# Altium project OSPLC2_2_IO.PrjPCB
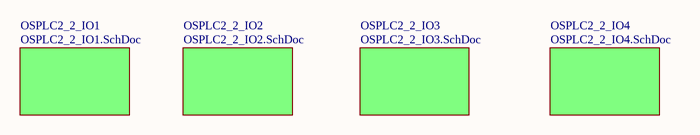
[diagram p0: OSPLC2_2_IO_Top.SchDoc]
5 sheets, 296 parts. Net scope: global (net labels, ports and power ports of the same name join across sheets).
Board file: OSPLC2_2_IO.PcbDoc
Sheets:
  OSPLC2_2_IO_Top.SchDoc
    OSPLC2_2_IO1 = OSPLC2_2_IO1.SchDoc
    OSPLC2_2_IO2 = OSPLC2_2_IO2.SchDoc
    OSPLC2_2_IO3 = OSPLC2_2_IO3.SchDoc
    OSPLC2_2_IO4 = OSPLC2_2_IO4.SchDoc

## Sheet OSPLC2_2_IO_Top.SchDoc
size 294 x 198 mm

### Sub-sheets
OSPLC2_2_IO1 = OSPLC2_2_IO1.SchDoc: no entries
OSPLC2_2_IO2 = OSPLC2_2_IO2.SchDoc: no entries
OSPLC2_2_IO3 = OSPLC2_2_IO3.SchDoc: no entries
OSPLC2_2_IO4 = OSPLC2_2_IO4.SchDoc: no entries

## Sheet OSPLC2_2_IO1.SchDoc
size 294 x 198 mm
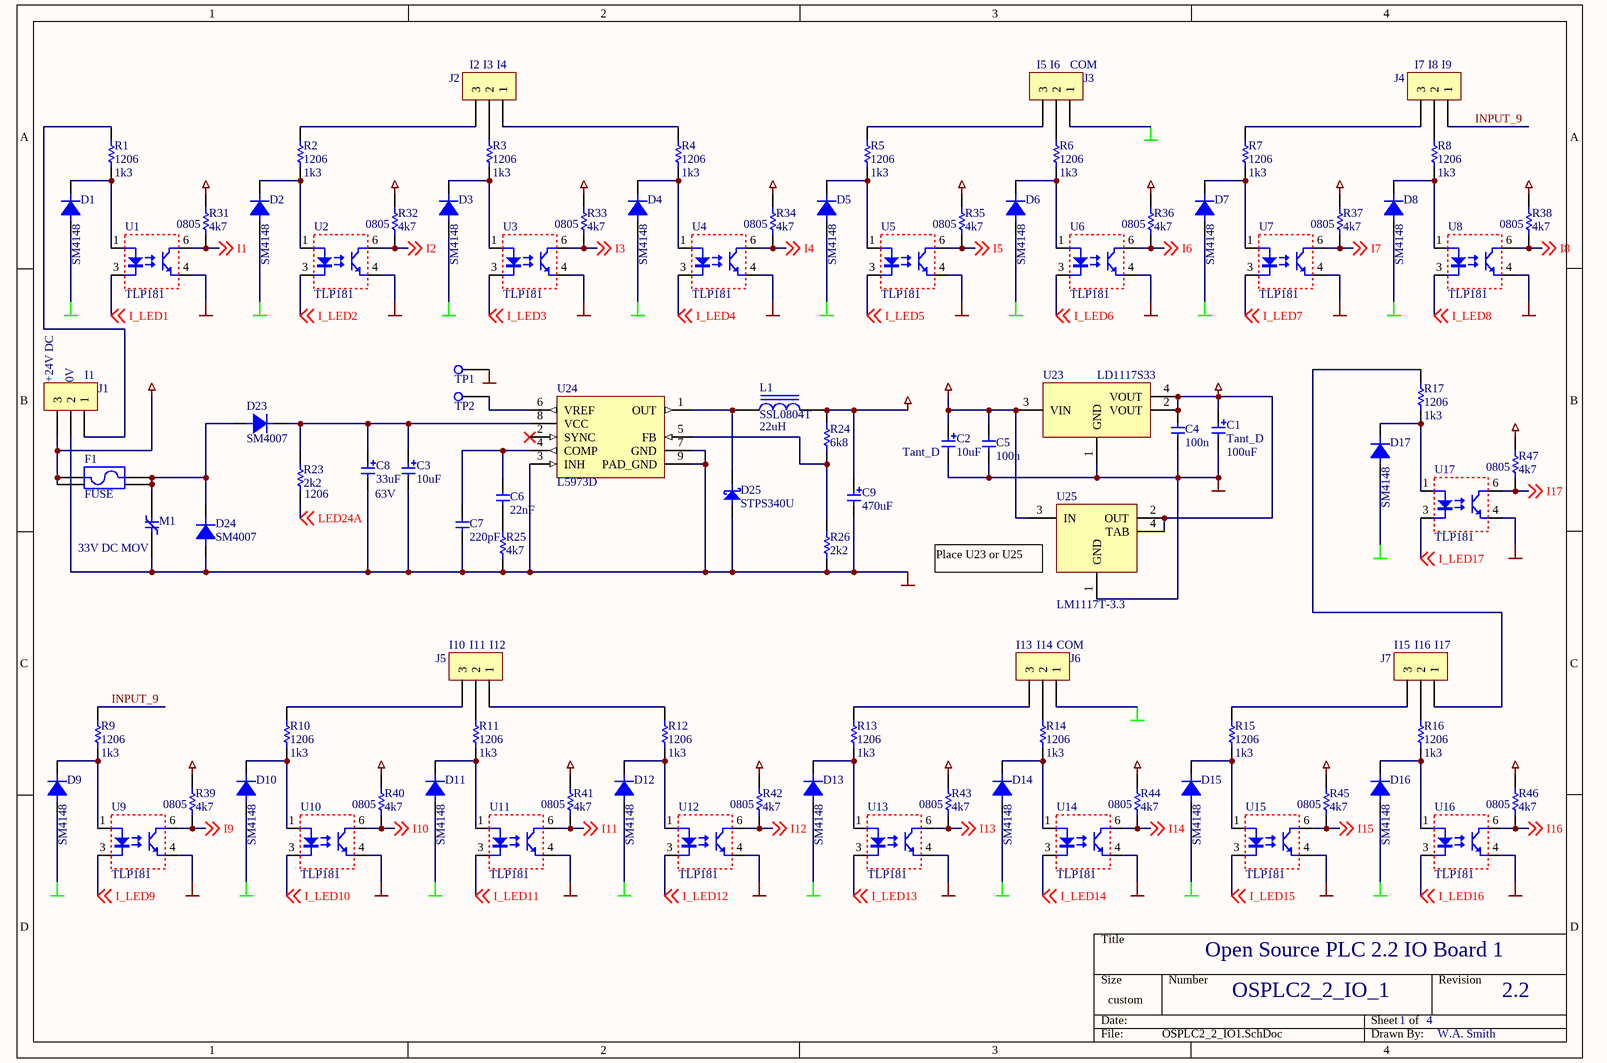
[diagram p1: OSPLC2_2_IO1.SchDoc]

### Parts
C1  Tant_D  value 100uF  [CAP_TANT_D]
C2  Tant_D  value 10uF  [CAP_TANT_D]
C3  value 10uF  [CAP_100_RP]  (hidden comment: CAP_100_RP)
C4  value 100n  [0805]  (hidden comment: 0805)
C5  value 100n  [0805]  (hidden comment: 0805)
C6  value 22nF  [0805]  (hidden comment: 0805)
C7  value 220pF  [0805]  (hidden comment: 0805)
C8  63V  value 33uF  [CAP_100_RP]
C9  value 470uF  [CAP_200_RP]  (hidden comment: CAP_200_RP)
D1  SM4148  [MELF-R2/X1.6]
D2  SM4148  [MELF-R2/X1.6]
D3  SM4148  [MELF-R2/X1.6]
D4  SM4148  [MELF-R2/X1.6]
D5  SM4148  [MELF-R2/X1.6]
D6  SM4148  [MELF-R2/X1.6]
D7  SM4148  [MELF-R2/X1.6]
D8  SM4148  [MELF-R2/X1.6]
D9  SM4148  [MELF-R2/X1.6]
D10  SM4148  [MELF-R2/X1.6]
D11  SM4148  [MELF-R2/X1.6]
D12  SM4148  [MELF-R2/X1.6]
D13  SM4148  [MELF-R2/X1.6]
D14  SM4148  [MELF-R2/X1.6]
D15  SM4148  [MELF-R2/X1.6]
D16  SM4148  [MELF-R2/X1.6]
D17  SM4148  [MELF-R2/X1.6]
D23  SM4007  [MELF-2.2x2.5]
D24  SM4007  [MELF-2.2x2.5]
D25  STPS340U  [STPS2L25U]
F1  FUSE  [FUSE_MULT]
J1  PCB TERMINAL  [TERMINAL_3WAY_5MM]  (value not drawn)
J2  PCB TERMINAL  [TERMINAL_3WAY_5MM]  (value not drawn)
J3  PCB TERMINAL  [TERMINAL_3WAY_5MM]  (value not drawn)
J4  PCB TERMINAL  [TERMINAL_3WAY_5MM]  (value not drawn)
J5  PCB TERMINAL  [TERMINAL_3WAY_5MM]  (value not drawn)
J6  PCB TERMINAL  [TERMINAL_3WAY_5MM]  (value not drawn)
J7  PCB TERMINAL  [TERMINAL_3WAY_5MM]  (value not drawn)
L1  SSL0804T  [SSL0804]
M1  33V DC MOV  [MOV_7.6mm]
R1  1206  value 1k3  [1206]
R2  1206  value 1k3  [1206]
R3  1206  value 1k3  [1206]
R4  1206  value 1k3  [1206]
R5  1206  value 1k3  [1206]
R6  1206  value 1k3  [1206]
R7  1206  value 1k3  [1206]
R8  1206  value 1k3  [1206]
R9  1206  value 1k3  [1206]
R10  1206  value 1k3  [1206]
R11  1206  value 1k3  [1206]
R12  1206  value 1k3  [1206]
R13  1206  value 1k3  [1206]
R14  1206  value 1k3  [1206]
R15  1206  value 1k3  [1206]
R16  1206  value 1k3  [1206]
R17  1206  value 1k3  [1206]
R23  1206  value 2k2  [1206]
R24  value 6k8  [0805]  (hidden comment: 0805)
R25  value 4k7  [0805]  (hidden comment: 0805)
R26  value 2k2  [0805]  (hidden comment: 0805)
R31  0805  value 4k7  [0805]
R32  0805  value 4k7  [0805]
R33  0805  value 4k7  [0805]
R34  0805  value 4k7  [0805]
R35  0805  value 4k7  [0805]
R36  0805  value 4k7  [0805]
R37  0805  value 4k7  [0805]
R38  0805  value 4k7  [0805]
R39  0805  value 4k7  [0805]
R40  0805  value 4k7  [0805]
R41  0805  value 4k7  [0805]
R42  0805  value 4k7  [0805]
R43  0805  value 4k7  [0805]
R44  0805  value 4k7  [0805]
R45  0805  value 4k7  [0805]
R46  0805  value 4k7  [0805]
R47  0805  value 4k7  [0805]
TP1  TEST POINT  [TEST_POINT_TH]  (value not drawn)
TP2  TEST POINT  [TEST_POINT_TH]  (value not drawn)
U1  TLP181  [SOP4_2.54]
U2  TLP181  [SOP4_2.54]
U3  TLP181  [SOP4_2.54]
U4  TLP181  [SOP4_2.54]
U5  TLP181  [SOP4_2.54]
U6  TLP181  [SOP4_2.54]
U7  TLP181  [SOP4_2.54]
U8  TLP181  [SOP4_2.54]
U9  TLP181  [SOP4_2.54]
U10  TLP181  [SOP4_2.54]
U11  TLP181  [SOP4_2.54]
U12  TLP181  [SOP4_2.54]
U13  TLP181  [SOP4_2.54]
U14  TLP181  [SOP4_2.54]
U15  TLP181  [SOP4_2.54]
U16  TLP181  [SOP4_2.54]
U17  TLP181  [SOP4_2.54]
U23  LD1117S33  [SOT-223]
U24  L5973D  [HSOP8]
U25  LM1117T-3.3  [TO-220_H]

### Nets
GND: C1.2 C2.2 C3.2 C4.2 C5.2 C7.1 C8.2 C9.2 D24.1(A) D25.2(A) J1.2 M1.1 R25.1 R26.1 TP1.1 U1.4 U2.4 U3.4 U4.4 U5.4 U6.4 U7.4 U8.4 U9.4 U10.4 U11.4 U12.4 U13.4 U14.4 U15.4 U16.4 U17.4 U23.1(GND) U24.3(INH) U24.7(GND) U24.9(PAD_GND) U25.1(GND)
IN_GND: D1.1(A) D2.1(A) D3.1(A) D4.1(A) D5.1(A) D6.1(A) D7.1(A) D8.1(A) D9.1(A) D10.1(A) D11.1(A) D12.1(A) D13.1(A) D14.1(A) D15.1(A) D16.1(A) D17.1(A) J3.1 J6.1
VCC3v3: C1.1 C4.1 R31.2 R32.2 R33.2 R34.2 R35.2 R36.2 R37.2 R38.2 R39.2 R40.2 R41.2 R42.2 R43.2 R44.2 R45.2 R46.2 R47.2 U23.2(VOUT) U23.4(VOUT) U25.2(OUT) U25.4(TAB)
VCC5: C2.1 C5.1 C9.1 L1.2 R24.2 U23.3(VIN) U25.3(IN)
VCC24: F1.1 F1.3 J1.3
I1: R31.1 U1.6 ; off-sheet I1
I2: R32.1 U2.6 ; off-sheet I2
I3: R33.1 U3.6 ; off-sheet I3
I4: R34.1 U4.6 ; off-sheet I4
I5: R35.1 U5.6 ; off-sheet I5
I6: R36.1 U6.6 ; off-sheet I6
I7: R37.1 U7.6 ; off-sheet I7
I8: R38.1 U8.6 ; off-sheet I8
I9: R39.1 U9.6 ; off-sheet I9
I10: R40.1 U10.6 ; off-sheet I10
I11: R41.1 U11.6 ; off-sheet I11
I12: R42.1 U12.6 ; off-sheet I12
I13: R43.1 U13.6 ; off-sheet I13
I14: R44.1 U14.6 ; off-sheet I14
I15: R45.1 U15.6 ; off-sheet I15
I16: R46.1 U16.6 ; off-sheet I16
I17: R47.1 U17.6 ; off-sheet I17
I_LED1: U1.3 ; off-sheet I_LED1
I_LED2: U2.3 ; off-sheet I_LED2
I_LED3: U3.3 ; off-sheet I_LED3
I_LED4: U4.3 ; off-sheet I_LED4
I_LED5: U5.3 ; off-sheet I_LED5
I_LED6: U6.3 ; off-sheet I_LED6
I_LED7: U7.3 ; off-sheet I_LED7
I_LED8: U8.3 ; off-sheet I_LED8
I_LED9: U9.3 ; off-sheet I_LED9
I_LED10: U10.3 ; off-sheet I_LED10
I_LED11: U11.3 ; off-sheet I_LED11
I_LED12: U12.3 ; off-sheet I_LED12
I_LED13: U13.3 ; off-sheet I_LED13
I_LED14: U14.3 ; off-sheet I_LED14
I_LED15: U15.3 ; off-sheet I_LED15
I_LED16: U16.3 ; off-sheet I_LED16
I_LED17: U17.3 ; off-sheet I_LED17
INPUT_9: J4.1 R9.2
LED24A: R23.1 ; off-sheet LED24A
NetC3_1: C3.1 C8.1 D23.2(C) R23.2 U24.8(VCC)
NetC6_1: C6.1 R25.2
NetC6_2: C6.2 C7.2 U24.4(COMP)
NetD1_2: D1.2(C) R1.1 U1.1
NetD2_2: D2.2(C) R2.1 U2.1
NetD3_2: D3.2(C) R3.1 U3.1
NetD4_2: D4.2(C) R4.1 U4.1
NetD5_2: D5.2(C) R5.1 U5.1
NetD6_2: D6.2(C) R6.1 U6.1
NetD7_2: D7.2(C) R7.1 U7.1
NetD8_2: D8.2(C) R8.1 U8.1
NetD9_2: D9.2(C) R9.1 U9.1
NetD10_2: D10.2(C) R10.1 U10.1
NetD11_2: D11.2(C) R11.1 U11.1
NetD12_2: D12.2(C) R12.1 U12.1
NetD13_2: D13.2(C) R13.1 U13.1
NetD14_2: D14.2(C) R14.1 U14.1
NetD15_2: D15.2(C) R15.1 U15.1
NetD16_2: D16.2(C) R16.1 U16.1
NetD17_2: D17.2(C) R17.1 U17.1
NetD23_1: D23.1(A) D24.2(C) F1.2 F1.4 M1.2
NetD25_1: D25.1(C) L1.1 U24.1(OUT)
NetJ1_1: J1.1 R1.2
NetJ2_1: J2.1 R4.2
NetJ2_2: J2.2 R3.2
NetJ2_3: J2.3 R2.2
NetJ3_2: J3.2 R6.2
NetJ3_3: J3.3 R5.2
NetJ4_2: J4.2 R8.2
NetJ4_3: J4.3 R7.2
NetJ5_1: J5.1 R12.2
NetJ5_2: J5.2 R11.2
NetJ5_3: J5.3 R10.2
NetJ6_2: J6.2 R14.2
NetJ6_3: J6.3 R13.2
NetJ7_1: J7.1 R17.2
NetJ7_2: J7.2 R16.2
NetJ7_3: J7.3 R15.2
NetR24_1: R24.1 R26.2 U24.5(FB)
NetTP2_1: TP2.1 U24.6(VREF)

Not connected (* = marked no-connect by the designer): U24 2(SYNC)*

### Notes on the sheet
- (near J2) I2
- (near J2) I3
- (near J2) I4
- (near J3) I5
- (near J3) I6
- (near J3) COM
- (near J4) I7
- (near J4) I8
- (near J4) I9
- (near J1) +24V DC
- (near J1) 0V
- (near J1) I1
- (near U25) Place U23 or U25
- (near J5) I10
- (near J5) I11
- (near J5) I12
- (near J6) I13
- (near J6) I14
- (near J6) COM
- (near J7) I15
- (near J7) I16
- (near J7) I17
- Open Source PLC 2.2 IO Board 1
- OSPLC2_2_IO_1
- 2.2
- 1
- 4
- W.A. Smith
- (in symbol SSL0804T) 22uH

### Library data of the parts
C1 C2 = CAP_TANT_D: Tantalum Capacitor, D package
C3 C8 = CAP_100_RP: Electrolytic cap, 100 mil pitch
C4-C7 = CAP_0805: 0805 footprint non-polarised capacitor
C9 = CAP_200_RP: Radial Electrolytic Capacitor, 200 thou pin spacing
D1-D17 = SM4148: SMT 1N4148 diode; Value: SM4148
D23 D24 = SM4007: 1A, 1000V MELF Rectifier; Value: SM4007
D25 = STPS340U: Power Schottky rectifier, ST
F1 = FUSE_MULTI: Fuse holder or Fuse clips for 20mm fuse; Value: FUSE
J1-J7 = TERMINAL_3WAY_5MM: 5mm spaced PCB terminal, 3 pole
L1 = SSL0804T: Yageo SMD Power Inductor
M1 = MOV_7.6MM: Metal Oxide Varistor
R1-R17 R23 = RES_1206: 1206 footprint resistor
R24-R26 R31-R47 = RES_0805: 0805 footprint resistor
TP1 TP2 = TEST_POINT_TH: Through hole test point
U1-U17 = TLP181: Toshiba Photocoupler; Value: TLP181
U23 = LD1117S33: ST 3.3V LDO regulator
U24 = L5973D: ST 2.5A switch step down switching regulator
U25 = LM1117T-3.3: National  800mA LDO regulator

## Sheet OSPLC2_2_IO2.SchDoc
size 294 x 198 mm
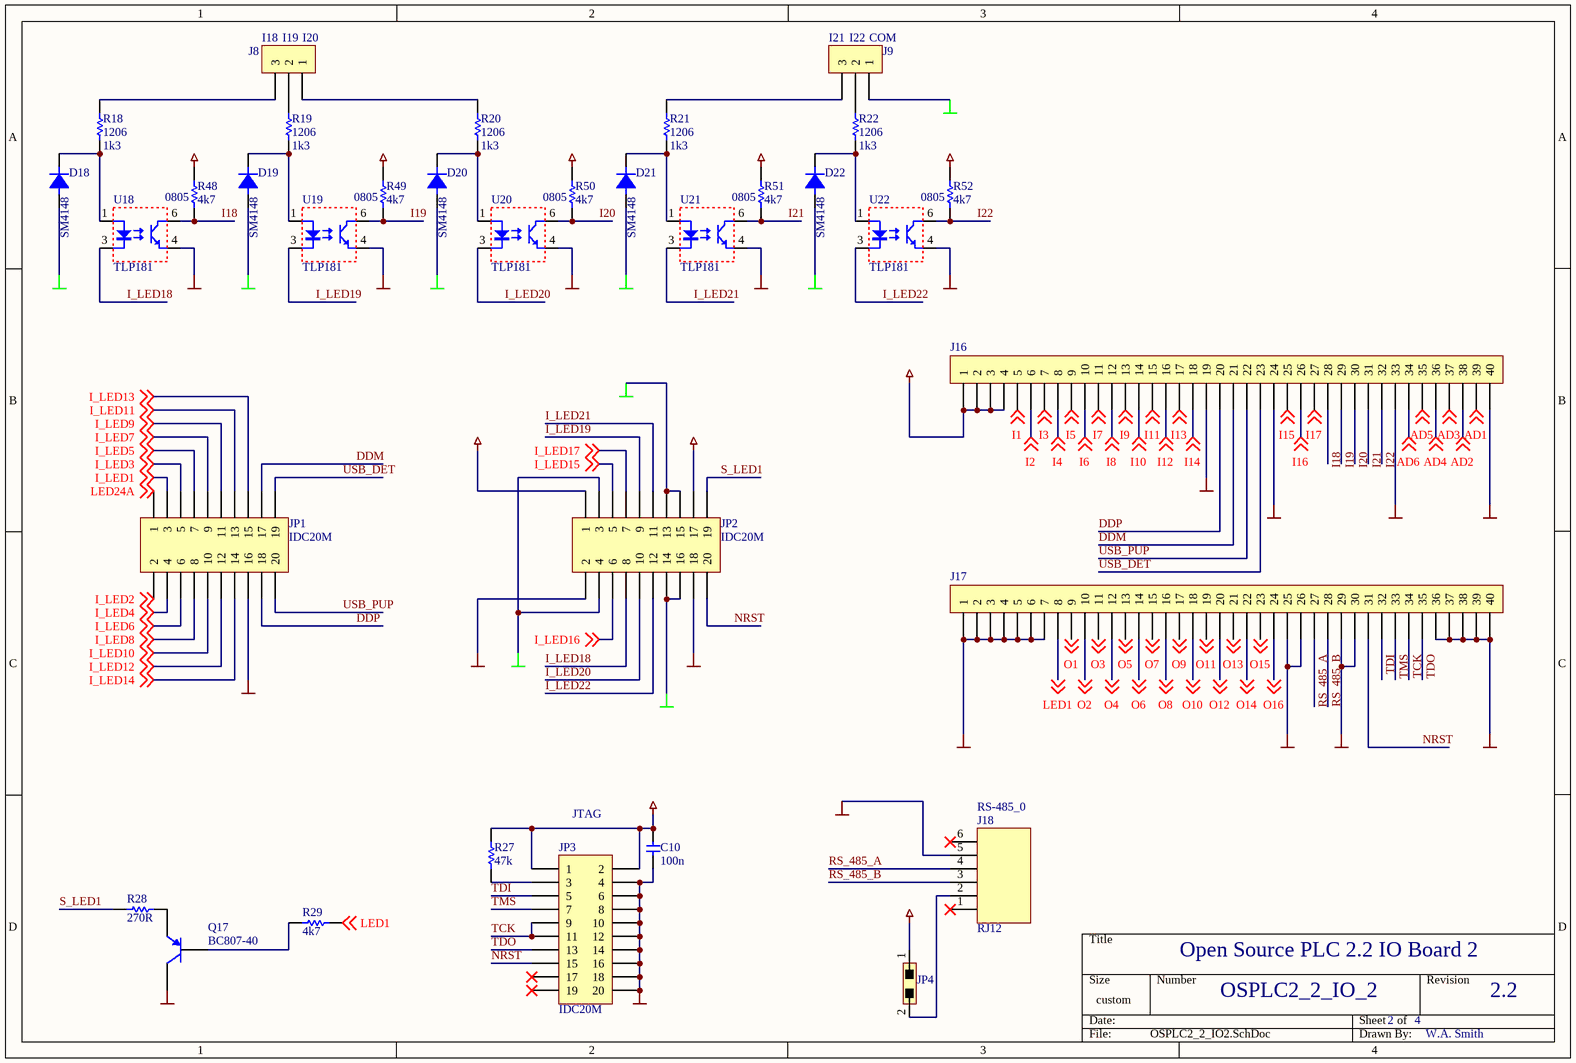
[diagram p2: OSPLC2_2_IO2.SchDoc]

### Parts
C10  value 100n  [0603]  (hidden comment: 0603)
D18  SM4148  [MELF-R2/X1.6]
D19  SM4148  [MELF-R2/X1.6]
D20  SM4148  [MELF-R2/X1.6]
D21  SM4148  [MELF-R2/X1.6]
D22  SM4148  [MELF-R2/X1.6]
J8  PCB TERMINAL  [TERMINAL_3WAY_5MM]  (value not drawn)
J9  PCB TERMINAL  [TERMINAL_3WAY_5MM]  (value not drawn)
J16  HEADER 1 x 40  [HEADER_1_40]  (value not drawn)
J17  HEADER 1 x 40  [HEADER_1_40]  (value not drawn)
J18  RJ12  [RJ-12-95001-2661]
JP1  IDC20M  [IDC_20M_BOX]
JP2  IDC20M  [IDC_20M_BOX]
JP3  IDC20M  [IDC_20M_BOX]
JP4  JUMPER2  [JUMPER2_254]  (value not drawn)
Q17  BC807-40  [SO-G3/Y1]
R18  1206  value 1k3  [1206]
R19  1206  value 1k3  [1206]
R20  1206  value 1k3  [1206]
R21  1206  value 1k3  [1206]
R22  1206  value 1k3  [1206]
R27  value 47k  [0805]  (hidden comment: 0805)
R28  value 270R  [0805]  (hidden comment: 0805)
R29  value 4k7  [0805]  (hidden comment: 0805)
R48  0805  value 4k7  [0805]
R49  0805  value 4k7  [0805]
R50  0805  value 4k7  [0805]
R51  0805  value 4k7  [0805]
R52  0805  value 4k7  [0805]
U18  TLP181  [SOP4_2.54]
U19  TLP181  [SOP4_2.54]
U20  TLP181  [SOP4_2.54]
U21  TLP181  [SOP4_2.54]
U22  TLP181  [SOP4_2.54]

### Nets
GND: C10.2 J16.19 J16.24 J16.33 J16.40 J17.1 J17.2 J17.3 J17.4 J17.5 J17.6 J17.7 J17.25 J17.26 J17.29 J17.30 J17.36 J17.37 J17.38 J17.39 J17.40 J18.5 JP1.16 JP2.2 JP2.18 JP3.4 JP3.6 JP3.8 JP3.10 JP3.12 JP3.14 JP3.16 JP3.18 JP3.20 Q17.3(C) U18.4 U19.4 U20.4 U21.4 U22.4
IN_GND: D18.1(A) D19.1(A) D20.1(A) D21.1(A) D22.1(A) J9.1 JP2.3 JP2.4 JP2.13 JP2.14 JP2.15 JP2.16
VCC3v3: C10.1 J16.1 J16.2 J16.3 J16.4 JP2.1 JP2.17 JP3.1 JP3.2 R27.2 R48.2 R49.2 R50.2 R51.2 R52.2
VCC5: JP4.1
AD1: J16.39 ; off-sheet AD1
AD2: J16.38 ; off-sheet AD2
AD3: J16.37 ; off-sheet AD3
AD4: J16.36 ; off-sheet AD4
AD5: J16.35 ; off-sheet AD5
AD6: J16.34 ; off-sheet AD6
DDM: J16.21 JP1.17
DDP: J16.20 JP1.18
I1: J16.5 ; off-sheet I1
I2: J16.6 ; off-sheet I2
I3: J16.7 ; off-sheet I3
I4: J16.8 ; off-sheet I4
I5: J16.9 ; off-sheet I5
I6: J16.10 ; off-sheet I6
I7: J16.11 ; off-sheet I7
I8: J16.12 ; off-sheet I8
I9: J16.13 ; off-sheet I9
I10: J16.14 ; off-sheet I10
I11: J16.15 ; off-sheet I11
I12: J16.16 ; off-sheet I12
I13: J16.17 ; off-sheet I13
I14: J16.18 ; off-sheet I14
I15: J16.25 ; off-sheet I15
I16: J16.26 ; off-sheet I16
I17: J16.27 ; off-sheet I17
I18: J16.28 R48.1 U18.6
I19: J16.29 R49.1 U19.6
I20: J16.30 R50.1 U20.6
I21: J16.31 R51.1 U21.6
I22: J16.32 R52.1 U22.6
I_LED1: JP1.3 ; off-sheet I_LED1
I_LED2: JP1.2 ; off-sheet I_LED2
I_LED3: JP1.5 ; off-sheet I_LED3
I_LED4: JP1.4 ; off-sheet I_LED4
I_LED5: JP1.7 ; off-sheet I_LED5
I_LED6: JP1.6 ; off-sheet I_LED6
I_LED7: JP1.9 ; off-sheet I_LED7
I_LED8: JP1.8 ; off-sheet I_LED8
I_LED9: JP1.11 ; off-sheet I_LED9
I_LED10: JP1.10 ; off-sheet I_LED10
I_LED11: JP1.13 ; off-sheet I_LED11
I_LED12: JP1.12 ; off-sheet I_LED12
I_LED13: JP1.15 ; off-sheet I_LED13
I_LED14: JP1.14 ; off-sheet I_LED14
I_LED15: JP2.5 ; off-sheet I_LED15
I_LED16: JP2.6 ; off-sheet I_LED16
I_LED17: JP2.7 ; off-sheet I_LED17
I_LED18: JP2.8 U18.3
I_LED19: JP2.9 U19.3
I_LED20: JP2.10 U20.3
I_LED21: JP2.11 U21.3
I_LED22: JP2.12 U22.3
LED1: J17.8 R29.2 ; off-sheet LED1
LED24A: JP1.1 ; off-sheet LED24A
NRST: J17.31 JP2.20 JP3.15
O1: J17.9 ; off-sheet O1
O2: J17.10 ; off-sheet O2
O3: J17.11 ; off-sheet O3
O4: J17.12 ; off-sheet O4
O5: J17.13 ; off-sheet O5
O6: J17.14 ; off-sheet O6
O7: J17.15 ; off-sheet O7
O8: J17.16 ; off-sheet O8
O9: J17.17 ; off-sheet O9
O10: J17.18 ; off-sheet O10
O11: J17.19 ; off-sheet O11
O12: J17.20 ; off-sheet O12
O13: J17.21 ; off-sheet O13
O14: J17.22 ; off-sheet O14
O15: J17.23 ; off-sheet O15
O16: J17.24 ; off-sheet O16
RS_485_A: J17.27 J18.4
RS_485_B: J17.28 J18.3
S_LED1: JP2.19 R28.1
TCK: J17.34 JP3.9 JP3.11
TDI: J17.32 JP3.5
TDO: J17.35 JP3.13
TMS: J17.33 JP3.7
USB_DET: J16.23 JP1.19
USB_PUP: J16.22 JP1.20
NetD18_2: D18.2(C) R18.1 U18.1
NetD19_2: D19.2(C) R19.1 U19.1
NetD20_2: D20.2(C) R20.1 U20.1
NetD21_2: D21.2(C) R21.1 U21.1
NetD22_2: D22.2(C) R22.1 U22.1
NetJ8_1: J8.1 R20.2
NetJ8_2: J8.2 R19.2
NetJ8_3: J8.3 R18.2
NetJ9_2: J9.2 R22.2
NetJ9_3: J9.3 R21.2
NetJ18_2: J18.2 JP4.2
NetJP3_3: JP3.3 R27.1
NetQ17_1: Q17.1(B) R29.1
NetQ17_2: Q17.2(E) R28.2

Not connected (* = marked no-connect by the designer): J18 1* 6*; JP3 17* 19*

### Notes on the sheet
- (near J8) I18
- (near J8) I19
- (near J8) I20
- (near J9) I21
- (near J9) I22
- (near J9) COM
- JTAG
- (near J18) RS-485_0
- Open Source PLC 2.2 IO Board 2
- OSPLC2_2_IO_2
- 2.2
- 2
- 4
- W.A. Smith

### Library data of the parts
C10 = CAP_0603: 0603 footprint non-polorised capacitor
D18-D22 = SM4148: SMT 1N4148 diode; Value: SM4148
J8 J9 = TERMINAL_3WAY_5MM: 5mm spaced PCB terminal, 3 pole
J16 J17 = HEADER_1_40: 2.54mm header, 1 by 40; Value: HEADER_1_40_2.54
J18 = RJ-12-95001-2661: RJ 12 Socket, Molex Part num. 95001-2661; Value: RJ12-95001-2661
JP1-JP3 = IDC_20M: 20 pin IDC male connector, vertical, box
JP4 = JUMPER2: 2 Pin Jumper, 2.54mm
Q17 = BC807-40: PNP General Purpose Amplifier; Manufacturer: Fairchild Semiconductor; Revision 1: 11-July-2000: SIM Model Added.; Revision 2: July-2002: Re-released for DXP Platform.; Package Information: Latest Revision: Sep-1998; Class I: Discrete; Class II: BJT - Low Power; Published: 8-Jun-2000; Datasheet: Latest Revision: 1997; Package Reference: SOT-23A; Publisher: Altium Limited
R18-R22 = RES_1206: 1206 footprint resistor
R27-R29 R48-R52 = RES_0805: 0805 footprint resistor
U18-U22 = TLP181: Toshiba Photocoupler; Value: TLP181

## Sheet OSPLC2_2_IO3.SchDoc
size 294 x 198 mm
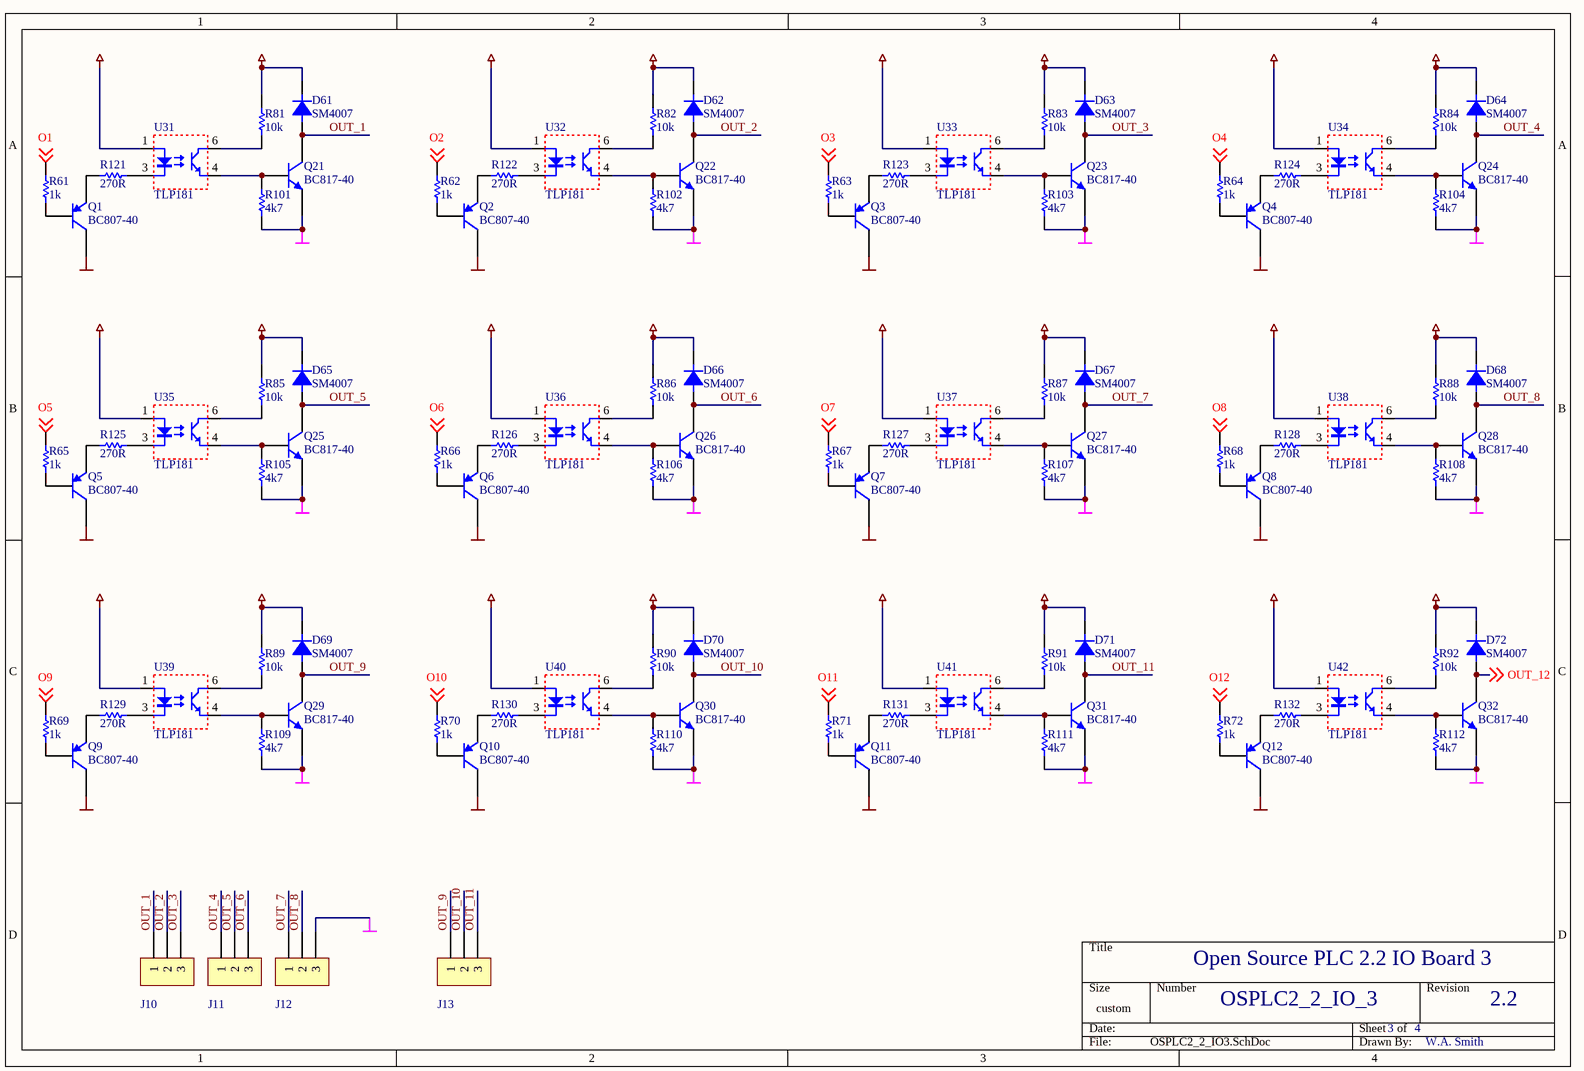
[diagram p3: OSPLC2_2_IO3.SchDoc]

### Parts
D61  SM4007  [MELF-2.2x2.5]
D62  SM4007  [MELF-2.2x2.5]
D63  SM4007  [MELF-2.2x2.5]
D64  SM4007  [MELF-2.2x2.5]
D65  SM4007  [MELF-2.2x2.5]
D66  SM4007  [MELF-2.2x2.5]
D67  SM4007  [MELF-2.2x2.5]
D68  SM4007  [MELF-2.2x2.5]
D69  SM4007  [MELF-2.2x2.5]
D70  SM4007  [MELF-2.2x2.5]
D71  SM4007  [MELF-2.2x2.5]
D72  SM4007  [MELF-2.2x2.5]
J10  PCB TERMINAL  [TERMINAL_3WAY_5MM]  (value not drawn)
J11  PCB TERMINAL  [TERMINAL_3WAY_5MM]  (value not drawn)
J12  PCB TERMINAL  [TERMINAL_3WAY_5MM]  (value not drawn)
J13  PCB TERMINAL  [TERMINAL_3WAY_5MM]  (value not drawn)
Q1  BC807-40  [SO-G3/Y1]
Q2  BC807-40  [SO-G3/Y1]
Q3  BC807-40  [SO-G3/Y1]
Q4  BC807-40  [SO-G3/Y1]
Q5  BC807-40  [SO-G3/Y1]
Q6  BC807-40  [SO-G3/Y1]
Q7  BC807-40  [SO-G3/Y1]
Q8  BC807-40  [SO-G3/Y1]
Q9  BC807-40  [SO-G3/Y1]
Q10  BC807-40  [SO-G3/Y1]
Q11  BC807-40  [SO-G3/Y1]
Q12  BC807-40  [SO-G3/Y1]
Q21  BC817-40  [SO-G3/Y1]
Q22  BC817-40  [SO-G3/Y1]
Q23  BC817-40  [SO-G3/Y1]
Q24  BC817-40  [SO-G3/Y1]
Q25  BC817-40  [SO-G3/Y1]
Q26  BC817-40  [SO-G3/Y1]
Q27  BC817-40  [SO-G3/Y1]
Q28  BC817-40  [SO-G3/Y1]
Q29  BC817-40  [SO-G3/Y1]
Q30  BC817-40  [SO-G3/Y1]
Q31  BC817-40  [SO-G3/Y1]
Q32  BC817-40  [SO-G3/Y1]
R61  value 1k  [0805]  (hidden comment: 0805)
R62  value 1k  [0805]  (hidden comment: 0805)
R63  value 1k  [0805]  (hidden comment: 0805)
R64  value 1k  [0805]  (hidden comment: 0805)
R65  value 1k  [0805]  (hidden comment: 0805)
R66  value 1k  [0805]  (hidden comment: 0805)
R67  value 1k  [0805]  (hidden comment: 0805)
R68  value 1k  [0805]  (hidden comment: 0805)
R69  value 1k  [0805]  (hidden comment: 0805)
R70  value 1k  [0805]  (hidden comment: 0805)
R71  value 1k  [0805]  (hidden comment: 0805)
R72  value 1k  [0805]  (hidden comment: 0805)
R81  value 10k  [0805]  (hidden comment: 0805)
R82  value 10k  [0805]  (hidden comment: 0805)
R83  value 10k  [0805]  (hidden comment: 0805)
R84  value 10k  [0805]  (hidden comment: 0805)
R85  value 10k  [0805]  (hidden comment: 0805)
R86  value 10k  [0805]  (hidden comment: 0805)
R87  value 10k  [0805]  (hidden comment: 0805)
R88  value 10k  [0805]  (hidden comment: 0805)
R89  value 10k  [0805]  (hidden comment: 0805)
R90  value 10k  [0805]  (hidden comment: 0805)
R91  value 10k  [0805]  (hidden comment: 0805)
R92  value 10k  [0805]  (hidden comment: 0805)
R101  value 4k7  [0805]  (hidden comment: 0805)
R102  value 4k7  [0805]  (hidden comment: 0805)
R103  value 4k7  [0805]  (hidden comment: 0805)
R104  value 4k7  [0805]  (hidden comment: 0805)
R105  value 4k7  [0805]  (hidden comment: 0805)
R106  value 4k7  [0805]  (hidden comment: 0805)
R107  value 4k7  [0805]  (hidden comment: 0805)
R108  value 4k7  [0805]  (hidden comment: 0805)
R109  value 4k7  [0805]  (hidden comment: 0805)
R110  value 4k7  [0805]  (hidden comment: 0805)
R111  value 4k7  [0805]  (hidden comment: 0805)
R112  value 4k7  [0805]  (hidden comment: 0805)
R121  value 270R  [0805]  (hidden comment: 0805)
R122  value 270R  [0805]  (hidden comment: 0805)
R123  value 270R  [0805]  (hidden comment: 0805)
R124  value 270R  [0805]  (hidden comment: 0805)
R125  value 270R  [0805]  (hidden comment: 0805)
R126  value 270R  [0805]  (hidden comment: 0805)
R127  value 270R  [0805]  (hidden comment: 0805)
R128  value 270R  [0805]  (hidden comment: 0805)
R129  value 270R  [0805]  (hidden comment: 0805)
R130  value 270R  [0805]  (hidden comment: 0805)
R131  value 270R  [0805]  (hidden comment: 0805)
R132  value 270R  [0805]  (hidden comment: 0805)
U31  TLP181  [SOP4_2.54]
U32  TLP181  [SOP4_2.54]
U33  TLP181  [SOP4_2.54]
U34  TLP181  [SOP4_2.54]
U35  TLP181  [SOP4_2.54]
U36  TLP181  [SOP4_2.54]
U37  TLP181  [SOP4_2.54]
U38  TLP181  [SOP4_2.54]
U39  TLP181  [SOP4_2.54]
U40  TLP181  [SOP4_2.54]
U41  TLP181  [SOP4_2.54]
U42  TLP181  [SOP4_2.54]

### Nets
GND: Q1.3(C) Q2.3(C) Q3.3(C) Q4.3(C) Q5.3(C) Q6.3(C) Q7.3(C) Q8.3(C) Q9.3(C) Q10.3(C) Q11.3(C) Q12.3(C)
OUT_GND: J12.3 Q21.2(E) Q22.2(E) Q23.2(E) Q24.2(E) Q25.2(E) Q26.2(E) Q27.2(E) Q28.2(E) Q29.2(E) Q30.2(E) Q31.2(E) Q32.2(E) R101.1 R102.1 R103.1 R104.1 R105.1 R106.1 R107.1 R108.1 R109.1 R110.1 R111.1 R112.1
VCC3v3: U31.1 U32.1 U33.1 U34.1 U35.1 U36.1 U37.1 U38.1 U39.1 U40.1 U41.1 U42.1
VCC24: D61.2(C) D62.2(C) D63.2(C) D64.2(C) D65.2(C) D66.2(C) D67.2(C) D68.2(C) D69.2(C) D70.2(C) D71.2(C) D72.2(C) R81.2 R82.2 R83.2 R84.2 R85.2 R86.2 R87.2 R88.2 R89.2 R90.2 R91.2 R92.2
O1: R61.2 ; off-sheet O1
O2: R62.2 ; off-sheet O2
O3: R63.2 ; off-sheet O3
O4: R64.2 ; off-sheet O4
O5: R65.2 ; off-sheet O5
O6: R66.2 ; off-sheet O6
O7: R67.2 ; off-sheet O7
O8: R68.2 ; off-sheet O8
O9: R69.2 ; off-sheet O9
O10: R70.2 ; off-sheet O10
O11: R71.2 ; off-sheet O11
O12: R72.2 ; off-sheet O12
OUT_1: D61.1(A) J10.1 Q21.3(C)
OUT_2: D62.1(A) J10.2 Q22.3(C)
OUT_3: D63.1(A) J10.3 Q23.3(C)
OUT_4: D64.1(A) J11.1 Q24.3(C)
OUT_5: D65.1(A) J11.2 Q25.3(C)
OUT_6: D66.1(A) J11.3 Q26.3(C)
OUT_7: D67.1(A) J12.1 Q27.3(C)
OUT_8: D68.1(A) J12.2 Q28.3(C)
OUT_9: D69.1(A) J13.1 Q29.3(C)
OUT_10: D70.1(A) J13.2 Q30.3(C)
OUT_11: D71.1(A) J13.3 Q31.3(C)
OUT_12: D72.1(A) Q32.3(C) ; off-sheet OUT_12
NetQ1_1: Q1.1(B) R61.1
NetQ1_2: Q1.2(E) R121.1
NetQ2_1: Q2.1(B) R62.1
NetQ2_2: Q2.2(E) R122.1
NetQ3_1: Q3.1(B) R63.1
NetQ3_2: Q3.2(E) R123.1
NetQ4_1: Q4.1(B) R64.1
NetQ4_2: Q4.2(E) R124.1
NetQ5_1: Q5.1(B) R65.1
NetQ5_2: Q5.2(E) R125.1
NetQ6_1: Q6.1(B) R66.1
NetQ6_2: Q6.2(E) R126.1
NetQ7_1: Q7.1(B) R67.1
NetQ7_2: Q7.2(E) R127.1
NetQ8_1: Q8.1(B) R68.1
NetQ8_2: Q8.2(E) R128.1
NetQ9_1: Q9.1(B) R69.1
NetQ9_2: Q9.2(E) R129.1
NetQ10_1: Q10.1(B) R70.1
NetQ10_2: Q10.2(E) R130.1
NetQ11_1: Q11.1(B) R71.1
NetQ11_2: Q11.2(E) R131.1
NetQ12_1: Q12.1(B) R72.1
NetQ12_2: Q12.2(E) R132.1
NetQ21_1: Q21.1(B) R101.2 U31.4
NetQ22_1: Q22.1(B) R102.2 U32.4
NetQ23_1: Q23.1(B) R103.2 U33.4
NetQ24_1: Q24.1(B) R104.2 U34.4
NetQ25_1: Q25.1(B) R105.2 U35.4
NetQ26_1: Q26.1(B) R106.2 U36.4
NetQ27_1: Q27.1(B) R107.2 U37.4
NetQ28_1: Q28.1(B) R108.2 U38.4
NetQ29_1: Q29.1(B) R109.2 U39.4
NetQ30_1: Q30.1(B) R110.2 U40.4
NetQ31_1: Q31.1(B) R111.2 U41.4
NetQ32_1: Q32.1(B) R112.2 U42.4
NetR81_1: R81.1 U31.6
NetR82_1: R82.1 U32.6
NetR83_1: R83.1 U33.6
NetR84_1: R84.1 U34.6
NetR85_1: R85.1 U35.6
NetR86_1: R86.1 U36.6
NetR87_1: R87.1 U37.6
NetR88_1: R88.1 U38.6
NetR89_1: R89.1 U39.6
NetR90_1: R90.1 U40.6
NetR91_1: R91.1 U41.6
NetR92_1: R92.1 U42.6
NetR121_2: R121.2 U31.3
NetR122_2: R122.2 U32.3
NetR123_2: R123.2 U33.3
NetR124_2: R124.2 U34.3
NetR125_2: R125.2 U35.3
NetR126_2: R126.2 U36.3
NetR127_2: R127.2 U37.3
NetR128_2: R128.2 U38.3
NetR129_2: R129.2 U39.3
NetR130_2: R130.2 U40.3
NetR131_2: R131.2 U41.3
NetR132_2: R132.2 U42.3

### Notes on the sheet
- Open Source PLC 2.2 IO Board 3
- OSPLC2_2_IO_3
- 2.2
- 3
- 4
- W.A. Smith

### Library data of the parts
D61-D72 = SM4007: 1A, 1000V MELF Rectifier; Value: SM4007
J10-J13 = TERMINAL_3WAY_5MM: 5mm spaced PCB terminal, 3 pole
Q1-Q12 = BC807-40: as Q17 on sheet OSPLC2_2_IO2; Published: 8-Jun-2000; Datasheet: Latest Revision: 1997; Package Reference: SOT-23A; Publisher: Altium Limited
Q21-Q32 = BC817-40: NPN General Purpose Amplifier; Manufacturer: Fairchild Semiconductor; Revision 1: 11-July-2000: SIM Model Added.; Revision 2: July-2002: Re-released for DXP Platform.; Package Information: Latest Revision: Sep-1998; Class I: Discrete; Class II: BJT - Low Power; Published: 8-Jun-2000; Datasheet: Latest Revision: 1997; Package Reference: SOT-23A; Publisher: Altium Limited
R61-R72 R81-R92 R101-R112 R121-R132 = RES_0805: 0805 footprint resistor
U31-U42 = TLP181: Toshiba Photocoupler

## Sheet OSPLC2_2_IO4.SchDoc
size 294 x 198 mm
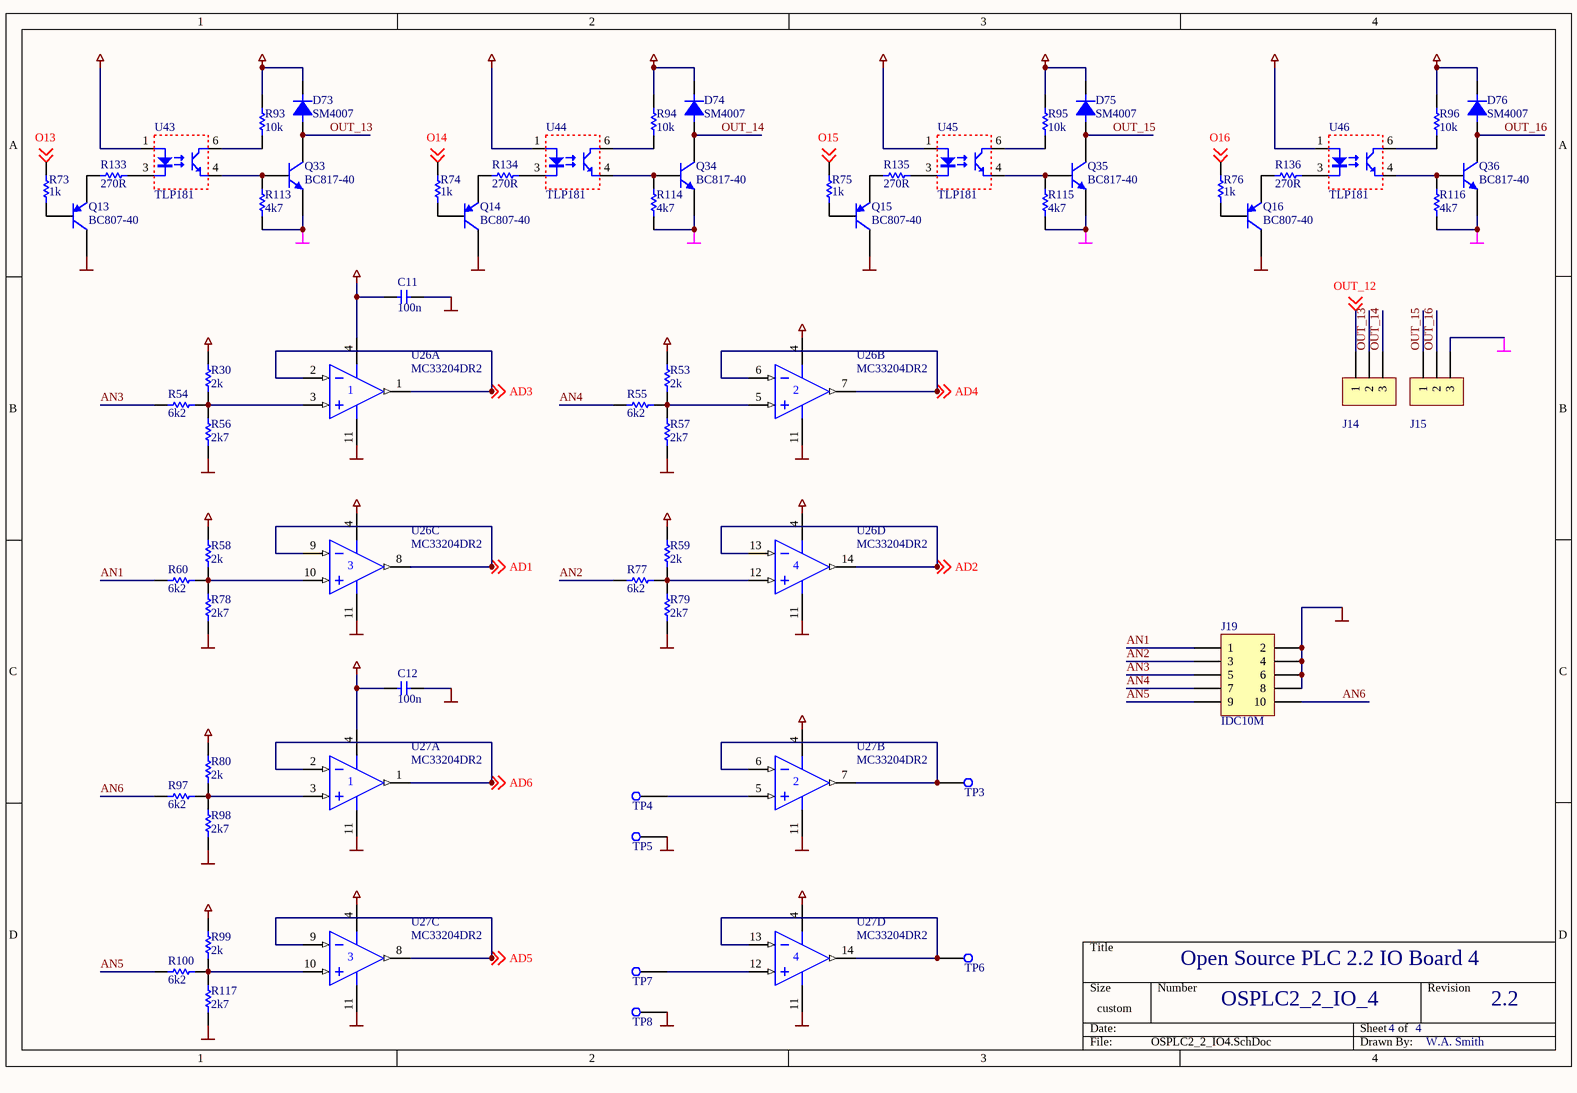
[diagram p4: OSPLC2_2_IO4.SchDoc]

### Parts
C11  value 100n  [0603]  (hidden comment: 0603)
C12  value 100n  [0603]  (hidden comment: 0603)
D73  SM4007  [MELF-2.2x2.5]
D74  SM4007  [MELF-2.2x2.5]
D75  SM4007  [MELF-2.2x2.5]
D76  SM4007  [MELF-2.2x2.5]
J14  PCB TERMINAL  [TERMINAL_3WAY_5MM]  (value not drawn)
J15  PCB TERMINAL  [TERMINAL_3WAY_5MM]  (value not drawn)
J19  IDC10M  [IDC_10M_BOX]
Q13  BC807-40  [SO-G3/Y1]
Q14  BC807-40  [SO-G3/Y1]
Q15  BC807-40  [SO-G3/Y1]
Q16  BC807-40  [SO-G3/Y1]
Q33  BC817-40  [SO-G3/Y1]
Q34  BC817-40  [SO-G3/Y1]
Q35  BC817-40  [SO-G3/Y1]
Q36  BC817-40  [SO-G3/Y1]
R30  value 2k  [0805]  (hidden comment: 0805)
R53  value 2k  [0805]  (hidden comment: 0805)
R54  value 6k2  [0805]  (hidden comment: 0805)
R55  value 6k2  [0805]  (hidden comment: 0805)
R56  value 2k7  [0805]  (hidden comment: 0805)
R57  value 2k7  [0805]  (hidden comment: 0805)
R58  value 2k  [0805]  (hidden comment: 0805)
R59  value 2k  [0805]  (hidden comment: 0805)
R60  value 6k2  [0805]  (hidden comment: 0805)
R73  value 1k  [0805]  (hidden comment: 0805)
R74  value 1k  [0805]  (hidden comment: 0805)
R75  value 1k  [0805]  (hidden comment: 0805)
R76  value 1k  [0805]  (hidden comment: 0805)
R77  value 6k2  [0805]  (hidden comment: 0805)
R78  value 2k7  [0805]  (hidden comment: 0805)
R79  value 2k7  [0805]  (hidden comment: 0805)
R80  value 2k  [0805]  (hidden comment: 0805)
R93  value 10k  [0805]  (hidden comment: 0805)
R94  value 10k  [0805]  (hidden comment: 0805)
R95  value 10k  [0805]  (hidden comment: 0805)
R96  value 10k  [0805]  (hidden comment: 0805)
R97  value 6k2  [0805]  (hidden comment: 0805)
R98  value 2k7  [0805]  (hidden comment: 0805)
R99  value 2k  [0805]  (hidden comment: 0805)
R100  value 6k2  [0805]  (hidden comment: 0805)
R113  value 4k7  [0805]  (hidden comment: 0805)
R114  value 4k7  [0805]  (hidden comment: 0805)
R115  value 4k7  [0805]  (hidden comment: 0805)
R116  value 4k7  [0805]  (hidden comment: 0805)
R117  value 2k7  [0805]  (hidden comment: 0805)
R133  value 270R  [0805]  (hidden comment: 0805)
R134  value 270R  [0805]  (hidden comment: 0805)
R135  value 270R  [0805]  (hidden comment: 0805)
R136  value 270R  [0805]  (hidden comment: 0805)
TP3  TEST POINT  [TEST_POINT_TH]  (value not drawn)
TP4  TEST POINT  [TEST_POINT_TH]  (value not drawn)
TP5  TEST POINT  [TEST_POINT_TH]  (value not drawn)
TP6  TEST POINT  [TEST_POINT_TH]  (value not drawn)
TP7  TEST POINT  [TEST_POINT_TH]  (value not drawn)
TP8  TEST POINT  [TEST_POINT_TH]  (value not drawn)
U26  MC33204DR2  [SO-G14]  (parts A,B,C,D of 4)
U27  MC33204DR2  [SO-G14]  (parts A,B,C,D of 4)
U43  TLP181  [SOP4_2.54]
U44  TLP181  [SOP4_2.54]
U45  TLP181  [SOP4_2.54]
U46  TLP181  [SOP4_2.54]

### Nets
GND: C11.2 C12.2 J19.2 J19.4 J19.6 J19.8 Q13.3(C) Q14.3(C) Q15.3(C) Q16.3(C) R56.1 R57.1 R78.1 R79.1 R98.1 R117.1 TP5.1 TP8.1 U26.11(V-) U27.11(V-)
OUT_GND: J15.3 Q33.2(E) Q34.2(E) Q35.2(E) Q36.2(E) R113.1 R114.1 R115.1 R116.1
VCC3v3: C11.1 C12.1 R30.2 R53.2 R58.2 R59.2 R80.2 R99.2 U26.4(V+) U27.4(V+) U43.1 U44.1 U45.1 U46.1
VCC24: D73.2(C) D74.2(C) D75.2(C) D76.2(C) R93.2 R94.2 R95.2 R96.2
AD1: U26.8(OUT) U26.9(IN-) ; off-sheet AD1
AD2: U26.13(IN-) U26.14(OUT) ; off-sheet AD2
AD3: U26.1(OUT) U26.2(IN-) ; off-sheet AD3
AD4: U26.6(IN-) U26.7(OUT) ; off-sheet AD4
AD5: U27.8(OUT) U27.9(IN-) ; off-sheet AD5
AD6: U27.1(OUT) U27.2(IN-) ; off-sheet AD6
AN1: J19.1 R60.1
AN2: J19.3 R77.1
AN3: J19.5 R54.1
AN4: J19.7 R55.1
AN5: J19.9 R100.1
AN6: J19.10 R97.1
O13: R73.2 ; off-sheet O13
O14: R74.2 ; off-sheet O14
O15: R75.2 ; off-sheet O15
O16: R76.2 ; off-sheet O16
OUT_12: J14.1 ; off-sheet OUT_12
OUT_13: D73.1(A) J14.2 Q33.3(C)
OUT_14: D74.1(A) J14.3 Q34.3(C)
OUT_15: D75.1(A) J15.1 Q35.3(C)
OUT_16: D76.1(A) J15.2 Q36.3(C)
NetQ13_1: Q13.1(B) R73.1
NetQ13_2: Q13.2(E) R133.1
NetQ14_1: Q14.1(B) R74.1
NetQ14_2: Q14.2(E) R134.1
NetQ15_1: Q15.1(B) R75.1
NetQ15_2: Q15.2(E) R135.1
NetQ16_1: Q16.1(B) R76.1
NetQ16_2: Q16.2(E) R136.1
NetQ33_1: Q33.1(B) R113.2 U43.4
NetQ34_1: Q34.1(B) R114.2 U44.4
NetQ35_1: Q35.1(B) R115.2 U45.4
NetQ36_1: Q36.1(B) R116.2 U46.4
NetR30_1: R30.1 R54.2 R56.2 U26.3(IN+)
NetR53_1: R53.1 R55.2 R57.2 U26.5(IN+)
NetR58_1: R58.1 R60.2 R78.2 U26.10(IN+)
NetR59_1: R59.1 R77.2 R79.2 U26.12(IN+)
NetR80_1: R80.1 R97.2 R98.2 U27.3(IN+)
NetR93_1: R93.1 U43.6
NetR94_1: R94.1 U44.6
NetR95_1: R95.1 U45.6
NetR96_1: R96.1 U46.6
NetR99_1: R99.1 R100.2 R117.2 U27.10(IN+)
NetR133_2: R133.2 U43.3
NetR134_2: R134.2 U44.3
NetR135_2: R135.2 U45.3
NetR136_2: R136.2 U46.3
NetTP3_1: TP3.1 U27.6(IN-) U27.7(OUT)
NetTP4_1: TP4.1 U27.5(IN+)
NetTP6_1: TP6.1 U27.13(IN-) U27.14(OUT)
NetTP7_1: TP7.1 U27.12(IN+)

### Notes on the sheet
- Open Source PLC 2.2 IO Board 4
- OSPLC2_2_IO_4
- 2.2
- 4
- W.A. Smith

### Library data of the parts
C11 C12 = CAP_0603: 0603 footprint non-polorised capacitor
D73-D76 = SM4007: 1A, 1000V MELF Rectifier; Value: SM4007
J14 J15 = TERMINAL_3WAY_5MM: 5mm spaced PCB terminal, 3 pole
J19 = IDC_10M: 10 pin IDC male connector, vertical, box
Q13-Q16 = BC807-40: as Q17 on sheet OSPLC2_2_IO2; Published: 8-Jun-2000; Datasheet: Latest Revision: 1997; Package Reference: SOT-23A; Publisher: Altium Limited
Q33-Q36 = BC817-40: as Q21 on sheet OSPLC2_2_IO3; Published: 8-Jun-2000; Datasheet: Latest Revision: 1997; Package Reference: SOT-23A; Publisher: Altium Limited
R30 R53-R60 R73-R80 R93-R100 R113-R117 R133-R136 = RES_0805: 0805 footprint resistor
TP3-TP8 = TEST_POINT_TH: Through hole test point
U26 U27 = MC33204DR2: Rail-to-Rail Quad Operational Amplifier; Manufacturer: Motorola; Package Information: Latest Revision: May-1997; Published: 15-Apr-2002; Revision: 23-Sep-2002: SIM Model Added.; Datasheet: Latest Revision: Nov-1999; Package Reference: 751A-03; Publisher: Altium Limited; Class I: Amplifier; Class II: Operational Amplifier
U43-U46 = TLP181: Toshiba Photocoupler

## Nets that join several sheets
GND: OSPLC2_2_IO1 (37 pins), OSPLC2_2_IO2 (40 pins), OSPLC2_2_IO3 (12 pins), OSPLC2_2_IO4 (20 pins)
IN_GND: OSPLC2_2_IO1 (19 pins), OSPLC2_2_IO2 (12 pins)
OUT_GND: OSPLC2_2_IO3 (25 pins), OSPLC2_2_IO4 (9 pins)
VCC3v3: OSPLC2_2_IO1 (23 pins), OSPLC2_2_IO2 (15 pins), OSPLC2_2_IO3 (12 pins), OSPLC2_2_IO4 (14 pins)
VCC5: OSPLC2_2_IO1 (7 pins), OSPLC2_2_IO2 (JP4.1)
VCC24: OSPLC2_2_IO1 (F1.1 F1.3 J1.3), OSPLC2_2_IO3 (24 pins), OSPLC2_2_IO4 (8 pins)
AD1: OSPLC2_2_IO2 (J16.39), OSPLC2_2_IO4 (U26.8 U26.9)
AD2: OSPLC2_2_IO2 (J16.38), OSPLC2_2_IO4 (U26.13 U26.14)
AD3: OSPLC2_2_IO2 (J16.37), OSPLC2_2_IO4 (U26.1 U26.2)
AD4: OSPLC2_2_IO2 (J16.36), OSPLC2_2_IO4 (U26.6 U26.7)
AD5: OSPLC2_2_IO2 (J16.35), OSPLC2_2_IO4 (U27.8 U27.9)
AD6: OSPLC2_2_IO2 (J16.34), OSPLC2_2_IO4 (U27.1 U27.2)
I1: OSPLC2_2_IO1 (R31.1 U1.6), OSPLC2_2_IO2 (J16.5)
I2: OSPLC2_2_IO1 (R32.1 U2.6), OSPLC2_2_IO2 (J16.6)
I3: OSPLC2_2_IO1 (R33.1 U3.6), OSPLC2_2_IO2 (J16.7)
I4: OSPLC2_2_IO1 (R34.1 U4.6), OSPLC2_2_IO2 (J16.8)
I5: OSPLC2_2_IO1 (R35.1 U5.6), OSPLC2_2_IO2 (J16.9)
I6: OSPLC2_2_IO1 (R36.1 U6.6), OSPLC2_2_IO2 (J16.10)
I7: OSPLC2_2_IO1 (R37.1 U7.6), OSPLC2_2_IO2 (J16.11)
I8: OSPLC2_2_IO1 (R38.1 U8.6), OSPLC2_2_IO2 (J16.12)
I9: OSPLC2_2_IO1 (R39.1 U9.6), OSPLC2_2_IO2 (J16.13)
I10: OSPLC2_2_IO1 (R40.1 U10.6), OSPLC2_2_IO2 (J16.14)
I11: OSPLC2_2_IO1 (R41.1 U11.6), OSPLC2_2_IO2 (J16.15)
I12: OSPLC2_2_IO1 (R42.1 U12.6), OSPLC2_2_IO2 (J16.16)
I13: OSPLC2_2_IO1 (R43.1 U13.6), OSPLC2_2_IO2 (J16.17)
I14: OSPLC2_2_IO1 (R44.1 U14.6), OSPLC2_2_IO2 (J16.18)
I15: OSPLC2_2_IO1 (R45.1 U15.6), OSPLC2_2_IO2 (J16.25)
I16: OSPLC2_2_IO1 (R46.1 U16.6), OSPLC2_2_IO2 (J16.26)
I17: OSPLC2_2_IO1 (R47.1 U17.6), OSPLC2_2_IO2 (J16.27)
I_LED1: OSPLC2_2_IO1 (U1.3), OSPLC2_2_IO2 (JP1.3)
I_LED2: OSPLC2_2_IO1 (U2.3), OSPLC2_2_IO2 (JP1.2)
I_LED3: OSPLC2_2_IO1 (U3.3), OSPLC2_2_IO2 (JP1.5)
I_LED4: OSPLC2_2_IO1 (U4.3), OSPLC2_2_IO2 (JP1.4)
I_LED5: OSPLC2_2_IO1 (U5.3), OSPLC2_2_IO2 (JP1.7)
I_LED6: OSPLC2_2_IO1 (U6.3), OSPLC2_2_IO2 (JP1.6)
I_LED7: OSPLC2_2_IO1 (U7.3), OSPLC2_2_IO2 (JP1.9)
I_LED8: OSPLC2_2_IO1 (U8.3), OSPLC2_2_IO2 (JP1.8)
I_LED9: OSPLC2_2_IO1 (U9.3), OSPLC2_2_IO2 (JP1.11)
I_LED10: OSPLC2_2_IO1 (U10.3), OSPLC2_2_IO2 (JP1.10)
I_LED11: OSPLC2_2_IO1 (U11.3), OSPLC2_2_IO2 (JP1.13)
I_LED12: OSPLC2_2_IO1 (U12.3), OSPLC2_2_IO2 (JP1.12)
I_LED13: OSPLC2_2_IO1 (U13.3), OSPLC2_2_IO2 (JP1.15)
I_LED14: OSPLC2_2_IO1 (U14.3), OSPLC2_2_IO2 (JP1.14)
I_LED15: OSPLC2_2_IO1 (U15.3), OSPLC2_2_IO2 (JP2.5)
I_LED16: OSPLC2_2_IO1 (U16.3), OSPLC2_2_IO2 (JP2.6)
I_LED17: OSPLC2_2_IO1 (U17.3), OSPLC2_2_IO2 (JP2.7)
LED24A: OSPLC2_2_IO1 (R23.1), OSPLC2_2_IO2 (JP1.1)
O1: OSPLC2_2_IO2 (J17.9), OSPLC2_2_IO3 (R61.2)
O2: OSPLC2_2_IO2 (J17.10), OSPLC2_2_IO3 (R62.2)
O3: OSPLC2_2_IO2 (J17.11), OSPLC2_2_IO3 (R63.2)
O4: OSPLC2_2_IO2 (J17.12), OSPLC2_2_IO3 (R64.2)
O5: OSPLC2_2_IO2 (J17.13), OSPLC2_2_IO3 (R65.2)
O6: OSPLC2_2_IO2 (J17.14), OSPLC2_2_IO3 (R66.2)
O7: OSPLC2_2_IO2 (J17.15), OSPLC2_2_IO3 (R67.2)
O8: OSPLC2_2_IO2 (J17.16), OSPLC2_2_IO3 (R68.2)
O9: OSPLC2_2_IO2 (J17.17), OSPLC2_2_IO3 (R69.2)
O10: OSPLC2_2_IO2 (J17.18), OSPLC2_2_IO3 (R70.2)
O11: OSPLC2_2_IO2 (J17.19), OSPLC2_2_IO3 (R71.2)
O12: OSPLC2_2_IO2 (J17.20), OSPLC2_2_IO3 (R72.2)
O13: OSPLC2_2_IO2 (J17.21), OSPLC2_2_IO4 (R73.2)
O14: OSPLC2_2_IO2 (J17.22), OSPLC2_2_IO4 (R74.2)
O15: OSPLC2_2_IO2 (J17.23), OSPLC2_2_IO4 (R75.2)
O16: OSPLC2_2_IO2 (J17.24), OSPLC2_2_IO4 (R76.2)
OUT_12: OSPLC2_2_IO3 (D72.1 Q32.3), OSPLC2_2_IO4 (J14.1)